# Altium schematic sheet Charging and Discharging Capacitors.schdoc: Charging / Discharging Capacitors
size A4; Organization: Altium Limited; Address1: L3, 12a Rodborough Rd; Address2: Frenchs Forest; Address3: NSW; Address4: Australia 2086; DocumentNumber: 1; SheetNumber: 1; SheetTotal: 1
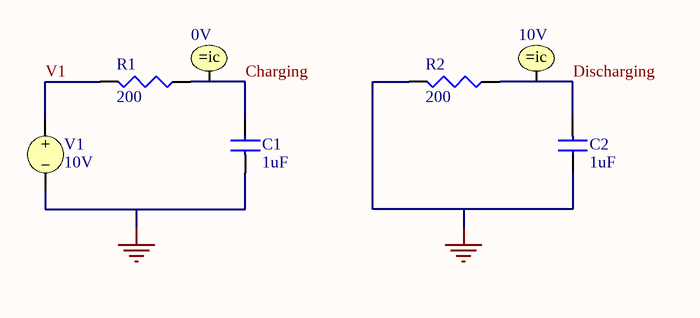
[diagram p0: Charging and Discharging Capacitors.schdoc]

## Parts
C1  1uF
C2  1uF
IC1  0V
IC2  10V
R1  200
R2  200
V1  10V

## Nets
GND: C1.1 C2.2 R2.1(TOP) V1.2
Charging: C1.2 IC1.1 R1.2(BOT)
Discharging: C2.1 IC2.1 R2.2(BOT)
V1: R1.1(TOP) V1.1

## Notes on the sheet
- Title
- Size:
- Date:
- A4
- Number:
- Time:
- Revision:
- Sheet
- of
- File:

## Library data of the parts
C1 C2 = CAP: Capacitor; Value: 1uF
IC1 IC2 = .IC: Initial Condition
  IC1: Initial Voltage: 0V
  IC2: Initial Voltage: 10V
R1 R2 = RES: Resistor; Value: 200
V1 = VSRC: Voltage Source; Value: 10V